# Altium schematic sheet OBC_MCU.SchDoc: MCU
size A3; SheetNumber: 5; SheetTotal: 10
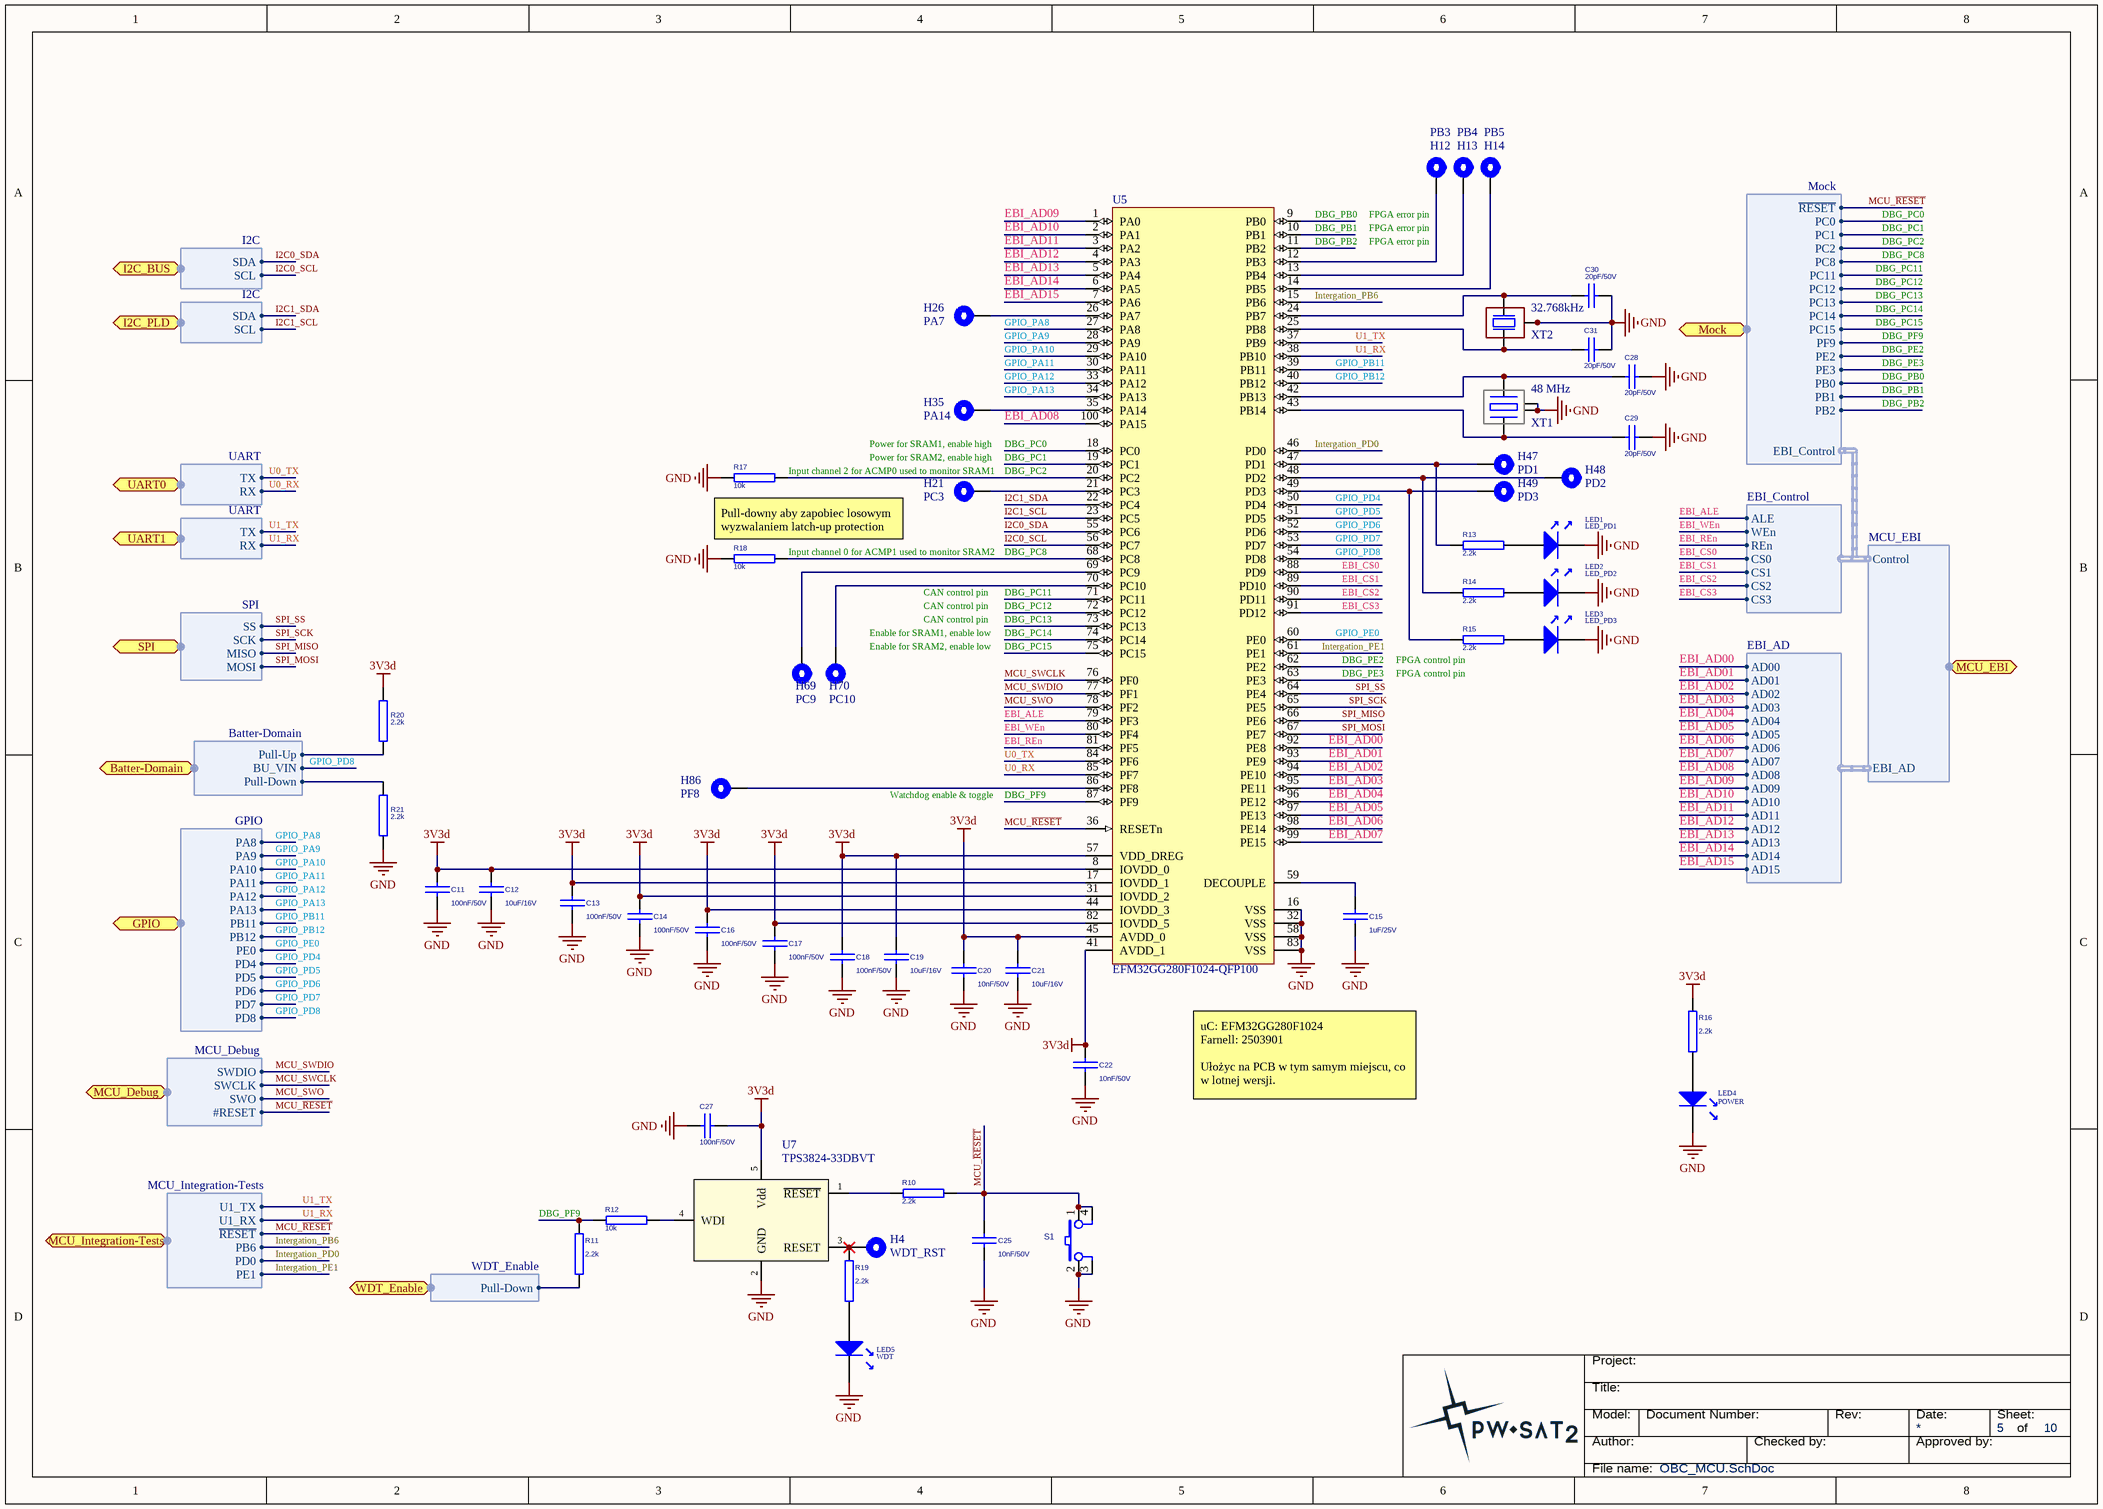
[diagram p0: OBC_MCU.SchDoc]

## Parts
C11  100nF/50V  [C0603]
C12  10uF/16V  [C1206]
C13  100nF/50V  [C0603]
C14  100nF/50V  [C0603]
C15  1uF/25V  [C1206]
C16  100nF/50V  [C0603]
C17  100nF/50V  [C0603]
C18  100nF/50V  [C0603]
C19  10uF/16V  [C1206]
C20  10nF/50V  [C0603]
C21  10uF/16V  [C1206]
C22  10nF/50V  [C0603]
C25  10nF/50V  [C0603]
C27  100nF/50V  [C0603]
C28  20pF/50V  [C0603]
C29  20pF/50V  [C0603]
C30  20pF/50V  [C0603]
C31  20pF/50V  [C0603]
H4  WDT_RST  [TESTPOINT]  (no BOM)
H12  PB3  [TESTPOINT]  (no BOM)
H13  PB4  [TESTPOINT]  (no BOM)
H14  PB5  [TESTPOINT]  (no BOM)
H21  PC3  [TESTPOINT]  (no BOM)
H26  PA7  [TESTPOINT]  (no BOM)
H35  PA14  [TESTPOINT]  (no BOM)
H47  PD1  [TESTPOINT]  (no BOM)
H48  PD2  [TESTPOINT]  (no BOM)
H49  PD3  [TESTPOINT]  (no BOM)
H69  PC9  [TESTPOINT]  (no BOM)
H70  PC10  [TESTPOINT]  (no BOM)
H86  PF8  [TESTPOINT]  (no BOM)
LED1  LED_PD1  [SMD_LED_1206]
LED2  LED_PD2  [SMD_LED_1206]
LED3  LED_PD3  [SMD_LED_1206]
LED4  POWER  [SMD_LED_1206]
LED5  WDT  [SMD_LED_1206]
R10  2.2k  [R0603]
R11  2.2k  [R0603]
R12  10k  [R0603]
R13  2.2k  [R0603]
R14  2.2k  [R0603]
R15  2.2k  [R0603]
R16  2.2k  [R0603]
R17  10k  [R0603]
R18  10k  [R0603]
R19  2.2k  [R0603]
R20  2.2k  [R0603]
R21  2.2k  [R0603]
S1  MC32882  [MC32882]  (value not drawn)
U5  EFM32GG280F1024-QFP100  [ENMR-LQFP100_L]
U7  TPS3824-33DBVT  [SOT23-5]
XT1  48 MHz  [SMD, 5mm x 3.2mm]
XT2  32.768kHz  [Epson_MC-306]

## Ports
Batter-Domain (harness Batter-Domain), GPIO (harness GPIO), I2C_BUS (harness I2C), I2C_PLD (harness I2C), MCU_Debug (harness MCU_Debug), MCU_EBI (harness MCU_EBI), MCU_Integration-Tests (harness MCU_Integration-Tests), Mock (harness Mock), SPI (harness SPI), UART0 (harness UART), UART1 (harness UART), WDT_Enable (harness WDT_Enable)

## Harnesses
I2C: SDA, SCL
MCU_EBI: EBI_AD, Control
EBI_AD: AD09, AD10, AD11, AD12, AD13, AD14, AD15, AD00, AD01, AD02, AD03, AD04, AD05, AD06, AD07, AD08
Mock: PC14, PC15, PF9, PE2, PE3, PB0, PB1, PB2, EBI_Control, PC0, PC1, PC2, PC8, ~{RESET}, PC11, PC12, PC13
UART: RX, TX
SPI: MISO, MOSI, SCK, SS
GPIO: PA8, PA9, PA10, PA11, PA12, PA13, PB11, PB12, PE0, PD4, PD5, PD6, PD7, PD8
EBI_Control: ALE, WEn, REn, CS0, CS1, CS2, CS3
MCU_Debug: SWDIO, SWCLK, SWO, #RESET
MCU_Integration-Tests: ~{RESET}, PB6, PD0, PE1, U1_TX, U1_RX
WDT_Enable: Pull-Down
Batter-Domain: BU_VIN, Pull-Up, Pull-Down

## Nets
3V3d: C11.1 C12.1 C13.1 C14.1 C16.1 C17.1 C18.1 C19.1 C20.1 C21.1 C22.1 C27.2 R16.2 R20.1 U5.8(IOVDD_0) U5.17(IOVDD_1) U5.31(IOVDD_2) U5.41(AVDD_1) U5.44(IOVDD_3) U5.45(AVDD_0) U5.57(VDD_DREG) U5.82(IOVDD_5) U7.5(Vdd)
GND: C11.2 C12.2 C13.2 C14.2 C15.2 C16.2 C17.2 C18.2 C19.2 C20.2 C21.2 C22.2 C25.2 C27.1 C28.2 C29.2 C30.1 C31.2 LED1.K LED2.K LED3.K LED4.K LED5.K R17.2 R18.2 R21.2 S1.2 S1.3 U5.16(VSS) U5.32(VSS) U5.58(VSS) U5.83(VSS) U7.2(GND) XT1.3(GND) XT1.4(GND) XT2.2(NC) XT2.3(NC)
DBG_PB0: U5.9(PB0) ; port Mock.PB0
DBG_PB1: U5.10(PB1) ; port Mock.PB1
DBG_PB2: U5.11(PB2) ; port Mock.PB2
DBG_PC0: U5.18(PC0) ; port Mock.PC0
DBG_PC1: U5.19(PC1) ; port Mock.PC1
DBG_PC2: R17.1 U5.20(PC2) ; port Mock.PC2
DBG_PC8: R18.1 U5.68(PC8) ; port Mock.PC8
DBG_PC11: U5.71(PC11) ; port Mock.PC11
DBG_PC12: U5.72(PC12) ; port Mock.PC12
DBG_PC13: U5.73(PC13) ; port Mock.PC13
DBG_PC14: U5.74(PC14) ; port Mock.PC14
DBG_PC15: U5.75(PC15) ; port Mock.PC15
DBG_PE2: U5.62(PE2) ; port Mock.PE2
DBG_PE3: U5.63(PE3) ; port Mock.PE3
DBG_PF9: R11.2 R12.2 U5.87(PF9) ; port Mock.PF9
EBI_AD00: U5.92(PE8) ; harness EBI_AD.AD00
EBI_AD01: U5.93(PE9) ; harness EBI_AD.AD01
EBI_AD02: U5.94(PE10) ; harness EBI_AD.AD02
EBI_AD03: U5.95(PE11) ; harness EBI_AD.AD03
EBI_AD04: U5.96(PE12) ; harness EBI_AD.AD04
EBI_AD05: U5.97(PE13) ; harness EBI_AD.AD05
EBI_AD06: U5.98(PE14) ; harness EBI_AD.AD06
EBI_AD07: U5.99(PE15) ; harness EBI_AD.AD07
EBI_AD08: U5.100(PA15) ; harness EBI_AD.AD08
EBI_AD09: U5.1(PA0) ; harness EBI_AD.AD09
EBI_AD10: U5.2(PA1) ; harness EBI_AD.AD10
EBI_AD11: U5.3(PA2) ; harness EBI_AD.AD11
EBI_AD12: U5.4(PA3) ; harness EBI_AD.AD12
EBI_AD13: U5.5(PA4) ; harness EBI_AD.AD13
EBI_AD14: U5.6(PA5) ; harness EBI_AD.AD14
EBI_AD15: U5.7(PA6) ; harness EBI_AD.AD15
EBI_ALE: U5.79(PF3) ; harness EBI_Control.ALE
EBI_CS0: U5.88(PD9) ; harness EBI_Control.CS0
EBI_CS1: U5.89(PD10) ; harness EBI_Control.CS1
EBI_CS2: U5.90(PD11) ; harness EBI_Control.CS2
EBI_CS3: U5.91(PD12) ; harness EBI_Control.CS3
EBI_REn: U5.81(PF5) ; harness EBI_Control.REn
EBI_WEn: U5.80(PF4) ; harness EBI_Control.WEn
GPIO_PA8: U5.27(PA8) ; port GPIO.PA8
GPIO_PA9: U5.28(PA9) ; port GPIO.PA9
GPIO_PA10: U5.29(PA10) ; port GPIO.PA10
GPIO_PA11: U5.30(PA11) ; port GPIO.PA11
GPIO_PA12: U5.33(PA12) ; port GPIO.PA12
GPIO_PA13: U5.34(PA13) ; port GPIO.PA13
GPIO_PB11: U5.39(PB11) ; port GPIO.PB11
GPIO_PB12: U5.40(PB12) ; port GPIO.PB12
GPIO_PD4: U5.50(PD4) ; port GPIO.PD4
GPIO_PD5: U5.51(PD5) ; port GPIO.PD5
GPIO_PD6: U5.52(PD6) ; port GPIO.PD6
GPIO_PD7: U5.53(PD7) ; port GPIO.PD7
GPIO_PD8: U5.54(PD8) ; port GPIO.PD8, port Batter-Domain.BU_VIN
GPIO_PE0: U5.60(PE0) ; port GPIO.PE0
I2C0_SCL: U5.56(PC7) ; port I2C_BUS.SCL
I2C0_SDA: U5.55(PC6) ; port I2C_BUS.SDA
I2C1_SCL: U5.23(PC5) ; port I2C_PLD.SCL
I2C1_SDA: U5.22(PC4) ; port I2C_PLD.SDA
Intergation_PB6: U5.15(PB6) ; port MCU_Integration-Tests.PB6
Intergation_PD0: U5.46(PD0) ; port MCU_Integration-Tests.PD0
Intergation_PE1: U5.61(PE1) ; port MCU_Integration-Tests.PE1
MCU_~{RESET}: C25.1 R10.1 S1.1 S1.4 U5.36(RESETn) ; port Mock.~{RESET}, port MCU_Debug.#RESET, port MCU_Integration-Tests.~{RESET}
MCU_SWCLK: U5.76(PF0) ; port MCU_Debug.SWCLK
MCU_SWDIO: U5.77(PF1) ; port MCU_Debug.SWDIO
MCU_SWO: U5.78(PF2) ; port MCU_Debug.SWO
SPI_MISO: U5.66(PE6) ; port SPI.MISO
SPI_MOSI: U5.67(PE7) ; port SPI.MOSI
SPI_SCK: U5.65(PE5) ; port SPI.SCK
SPI_SS: U5.64(PE4) ; port SPI.SS
U0_RX: U5.85(PF7) ; port UART0.RX
U0_TX: U5.84(PF6) ; port UART0.TX
U1_RX: U5.38(PB10) ; port UART1.RX, port MCU_Integration-Tests.U1_RX
U1_TX: U5.37(PB9) ; port UART1.TX, port MCU_Integration-Tests.U1_TX
NetC15_1: C15.1 U5.59(DECOUPLE)
NetC28_1: C28.1 U5.42(PB13) XT1.2(out)
NetC29_1: C29.1 U5.43(PB14) XT1.1(inp)
NetC30_2: C30.2 U5.24(PB7) XT2.4(out)
NetC31_1: C31.1 U5.25(PB8) XT2.1(inp)
NetH4_1: H4.1 R19.2 U7.3(RESET)
NetH12_1: H12.1 U5.12(PB3)
NetH13_1: H13.1 U5.13(PB4)
NetH14_1: H14.1 U5.14(PB5)
NetH21_1: H21.1 U5.21(PC3)
NetH26_1: H26.1 U5.26(PA7)
NetH35_1: H35.1 U5.35(PA14)
NetH47_1: H47.1 R13.2 U5.47(PD1)
NetH48_1: H48.1 R14.2 U5.48(PD2)
NetH49_1: H49.1 R15.2 U5.49(PD3)
NetH69_1: H69.1 U5.69(PC9)
NetH70_1: H70.1 U5.70(PC10)
NetH86_1: H86.1 U5.86(PF8)
NetLED1_A: LED1.A R13.1
NetLED2_A: LED2.A R14.1
NetLED3_A: LED3.A R15.1
NetLED4_A: LED4.A R16.1
NetLED5_A: LED5.A R19.1
NetR10_2: R10.2 U7.1(~{RESET})
NetR11_1: R11.1 ; port WDT_Enable.Pull-Down
NetR12_1: R12.1 U7.4(WDI)
NetR20_2: R20.2 ; port Batter-Domain.Pull-Up
NetR21_1: R21.1 ; port Batter-Domain.Pull-Down

## Notes on the sheet
- FPGA error pin
- Power for SRAM1, enable high
- Input channel 2 for ACMP0 used to monitor SRAM1
- Power for SRAM2, enable high
- Pull-downy aby zapobiec losowym wyzwalaniem latch-up protection
- (near R18) Input channel 0 for ACMP1 used to monitor SRAM2
- (near H70) Enable for SRAM1, enable low
- (near H70) Enable for SRAM2, enable low
- CAN control pin
- (near R15) FPGA control pin
- Watchdog enable & toggle
- uC: EFM32GG280F1024
  Farnell: 2503901
  Ułożyc na PCB w tym samym miejscu, co w lotnej wersji.
- Title:
- Project:
- Author:
- Model:
- Document Number:
- Checked by:
- Rev:
- Date:
- Approved by:
- Sheet:
- of
- File name:

## Library data of the parts
C11 C13 C14 C16-C18 C27 = CAP: Capacitator; Voltage: 50V; Material: X7R; Value: 100nF; Farnell: 1759122; Supplier Part Number 1: 1759122; Supplier 1: Farnell
C12 C19 C21 = CAP: Capacitator; Voltage: 16V; Material: X5R; Value: 10uF; Farnell: 2320922; Supplier Part Number 1: 2320922; Supplier 1: Farnell
C15 = CAP: Capacitator; Voltage: 25V; Material: X8R; Value: 1uF; Farnell: 2112718; Supplier Part Number 1: 2112718; Supplier 1: Farnell
C20 C22 C25 = CAP: Capacitator; Voltage: 50V; Material: X7R; Value: 10nF; Farnell: 9406182; Supplier Part Number 1: 9406182; Supplier 1: Farnell
C28-C31 = CAP: Capacitator; Voltage: 50V; Material: NP0; Value: 20pF; Farnell: 2627117; Supplier Part Number 1: 2627117; Supplier 1: Farnell
H4 H12-H14 H21 H26 H35 H47-H49 H69 H70 H86 = Wire_AWG-30: An AWG-30 wire solder point.
LED1-LED5 = LED-1206_RED: LED diode, SMD1206 package.; Supplier 1: Farnell; Farnell: 1581229
  LED1: Value: LED_PD1
  LED2: Value: LED_PD2
  LED3: Value: LED_PD3
  LED4: Value: POWER
  LED5: Value: WDT
R10-R21 = RES: Resistor; Tolerance: 1%; Supplier 1: Farnell
  R10 R11 R13-R16 R19-R21: Farnell: 9330810; Value: 2.2k; Supplier Part Number 1: 9330810
  R12 R17 R18: Farnell: 2446547; Value: 10k; Supplier Part Number 1: 2446547
S1 = SW PUSHBUTTON_0: Button; Manufacturer: Multicomp; Comp Type: SMD; Design: M; Sourcing: Fixed; Value: MC32882; Supplier 1: Farnell; Supplier Part Number 1: 2396053; partNo: MC32882; Pricing: 0,472; Farnell: 2396053; EMS Mounting: M
U5 = EFM32GG280F1024-QFP100: EFM32 Giant Gecko, M3 ARM Cortex CPU, 1024 KB Flash, 128 KB RAM, 1.85 - 3.8 V Supply, 48 MHz Max Speed, -40 to 85 degC, 100-Pin LQFP, RoHS Compliant; Manufacturer: Silicon Labs; Supplier 1: Digi-Key; DigiKey: 914-1061-1-ND; partNo: EFM32GG280F1024-QFP100; HelpUrl: http://www.silabs.com/documents/public/data-sheets/EFM32GG280.pdf
U7 = TPS3824-33DBVT: Voltage Monitor With Watchdog Timer; Manufacturer: Texas Instruments; Supplier 1: Digi-Key; DigiKey: 296-26951-1-ND; partNo: TPS3824-33DBVT; HelpUrl: http://www.ti.com/lit/ds/symlink/tps3828.pdf
XT1 = ABM3B-8.000MHZ-B2-T: Resonator Ceramic; Manufacturer Part Number: ABM3B-48.000MHZ-B2-T; value: 48 MHz; Supplier 1: Farnell; Farnell: 2467815
XT2 = Q13MC30610003: EPSON MC-306 32.768KHZ 12.5pF Crystal; Manufacturer: Epson; ManufacturerPartNumber: Q13MC30610003; Value: 32.768kHz